# Altium schematic sheet FETs.SchDoc
size A4
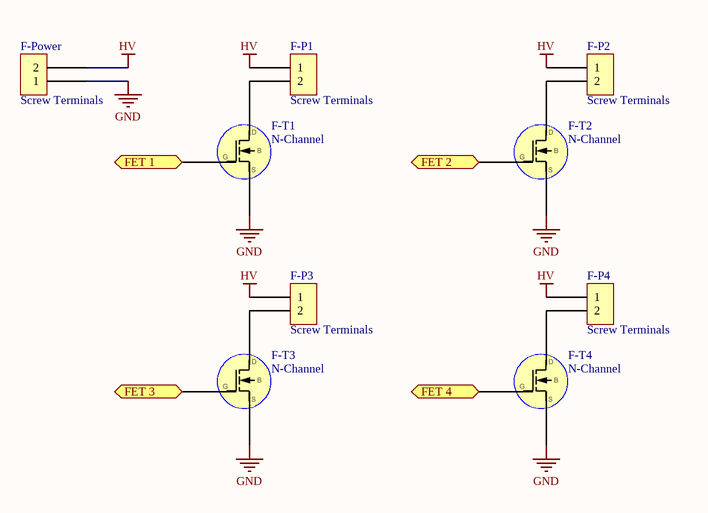
[diagram p0: FETs.SchDoc]

## Parts
F-P1  Screw Terminals  [DG301-5.0-02]
F-P2  Screw Terminals  [DG301-5.0-02]
F-P3  Screw Terminals  [DG301-5.0-02]
F-P4  Screw Terminals  [DG301-5.0-02]
F-Power  Screw Terminals  [DG301-5.0-02]
F-T1  N-Channel  [TO-220 AB]
F-T2  N-Channel  [TO-220 AB]
F-T3  N-Channel  [TO-220 AB]
F-T4  N-Channel  [TO-220 AB]

## Ports
FET 1 (in), FET 2 (in), FET 3 (in), FET 4 (in)

## Nets
GND: F-Power.1 F-T1.3 F-T2.3 F-T3.3 F-T4.3
HV: F-P1.1 F-P2.1 F-P3.1 F-P4.1 F-Power.2
FET 1: F-T1.1 ; port FET 1
FET 2: F-T2.1 ; port FET 2
FET 3: F-T3.1 ; port FET 3
FET 4: F-T4.1 ; port FET 4
NetF-P1_2: F-P1.2 F-T1.2
NetF-P2_2: F-P2.2 F-T2.2
NetF-P3_2: F-P3.2 F-T3.2
NetF-P4_2: F-P4.2 F-T4.2

## Library data of the parts
F-P1-F-P4 F-Power = Header 2x1
F-T1-F-T4 = FET N-Channel: Enhancement Type